# Altium schematic sheet 02-BlockChart.SchDoc
size A3; SheetNumber: 1; SheetTotal: 7
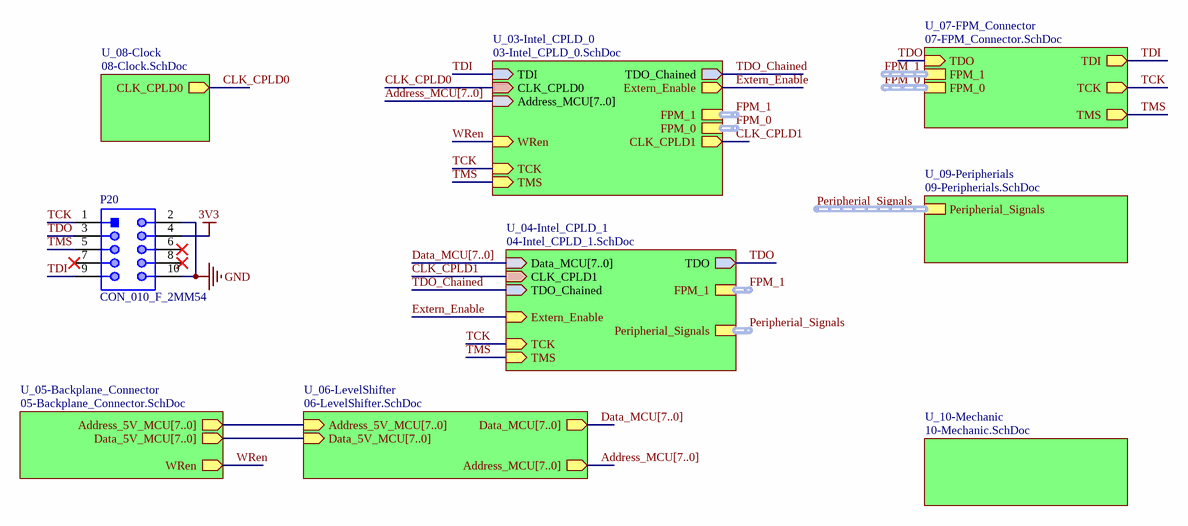
[diagram p0: 02-BlockChart.SchDoc]

## Parts
P20  CON_010_F_2MM54  [CON_010_F_2MM54_Intel_Altera]

## Sub-sheets
U_03-Intel_CPLD_0 = 03-Intel_CPLD_0.SchDoc: TDI (in), TDO_Chained (out), CLK_CPLD0 (in), Address_MCU[7..0] (in), Extern_Enable (out), FPM_1 (harness FPM_Signals_CPLD_1), FPM_0 (harness FPM_Signals_CPLD_0), WRen (in), CLK_CPLD1 (out), TCK (in), TMS (in)
U_04-Intel_CPLD_1 = 04-Intel_CPLD_1.SchDoc: Data_MCU[7..0] (in), CLK_CPLD1 (in), TDO_Chained (in), TDO (out), FPM_1 (harness FPM_Signals_CPLD_1), Extern_Enable (in), Peripherial_Signals (harness Peripherial_Signals), TCK (in), TMS (in)
U_05-Backplane_Connector = 05-Backplane_Connector.SchDoc: Address_5V_MCU[7..0] (out), Data_5V_MCU[7..0] (out), WRen (out)
U_06-LevelShifter = 06-LevelShifter.SchDoc: Address_5V_MCU[7..0] (in), Data_5V_MCU[7..0] (in), Data_MCU[7..0] (out), Address_MCU[7..0] (out)
U_07-FPM_Connector = 07-FPM_Connector.SchDoc: TDI (out), TDO (in), FPM_1 (harness FPM_Signals_CPLD_1), FPM_0 (harness FPM_Signals_CPLD_0), TCK (out), TMS (out)
U_08-Clock = 08-Clock.SchDoc: CLK_CPLD0 (out)
U_09-Peripherials = 09-Peripherials.SchDoc: Peripherial_Signals (harness Peripherial_Signals)
U_10-Mechanic = 10-Mechanic.SchDoc: no entries

## Nets
3V3: P20.4
GND: P20.2 P20.10
CLK_CPLD0: sheet U_03-Intel_CPLD_0/CLK_CPLD0, sheet U_08-Clock/CLK_CPLD0
CLK_CPLD1: sheet U_03-Intel_CPLD_0/CLK_CPLD1, sheet U_04-Intel_CPLD_1/CLK_CPLD1
Extern_Enable: sheet U_03-Intel_CPLD_0/Extern_Enable, sheet U_04-Intel_CPLD_1/Extern_Enable
TCK: P20.1 ; sheet U_03-Intel_CPLD_0/TCK, sheet U_04-Intel_CPLD_1/TCK, sheet U_07-FPM_Connector/TCK
TDI: P20.9 ; sheet U_03-Intel_CPLD_0/TDI, sheet U_07-FPM_Connector/TDI
TDO: P20.3 ; sheet U_04-Intel_CPLD_1/TDO, sheet U_07-FPM_Connector/TDO
TDO_Chained: sheet U_03-Intel_CPLD_0/TDO_Chained, sheet U_04-Intel_CPLD_1/TDO_Chained
TMS: P20.5 ; sheet U_03-Intel_CPLD_0/TMS, sheet U_04-Intel_CPLD_1/TMS, sheet U_07-FPM_Connector/TMS
WRen: sheet U_03-Intel_CPLD_0/WRen, sheet U_05-Backplane_Connector/WRen

Not connected (* = marked no-connect by the designer): P20 6* 7* 8*

## Buses and harness runs
bus Address_MCU[7..0] = sheet U_03-Intel_CPLD_0/Address_MCU[7..0]
bus Address_MCU[7..0] = sheet U_06-LevelShifter/Address_MCU[7..0]
bus Data_MCU[7..0] = sheet U_04-Intel_CPLD_1/Data_MCU[7..0]
bus Data_MCU[7..0] = sheet U_06-LevelShifter/Data_MCU[7..0]
bus sheet U_05-Backplane_Connector/Address_5V_MCU[7..0] = sheet U_06-LevelShifter/Address_5V_MCU[7..0]
bus sheet U_05-Backplane_Connector/Data_5V_MCU[7..0] = sheet U_06-LevelShifter/Data_5V_MCU[7..0]
harness FPM_0 = sheet U_03-Intel_CPLD_0/FPM_0
harness FPM_0 = sheet U_07-FPM_Connector/FPM_0
harness FPM_1 = sheet U_03-Intel_CPLD_0/FPM_1
harness FPM_1 = sheet U_04-Intel_CPLD_1/FPM_1
harness FPM_1 = sheet U_07-FPM_Connector/FPM_1
harness Peripherial_Signals = sheet U_04-Intel_CPLD_1/Peripherial_Signals
harness Peripherial_Signals = sheet U_09-Peripherials/Peripherial_Signals

## Notes on the sheet
- Title:
- Date:
- SVN:
- Ver:
- Sheet Size:
- A3
- Sheet Name:
- OF
- Checked By:
- Drawn By:
- Damian Szczypior
- Rev:
- Alle Rechte vorbehalten. Kopien ohne Erlaubnis der X2E GmbH sind nicht gestattet. Dieses Dokument darf ohne die Erlaubnis der X2E GmbH nicht an Dritte (auch nicht in Auszügen) weitergegeben werden .
- Sheet:

## Library data of the parts
P20 = CON_010_F_2MM54: Male Box Header WR-BHD, THT, Vertical, pitch 2.54 mm, 10 pins